# EAGLE design BME280 breakout (EAGLE 7.3.0)
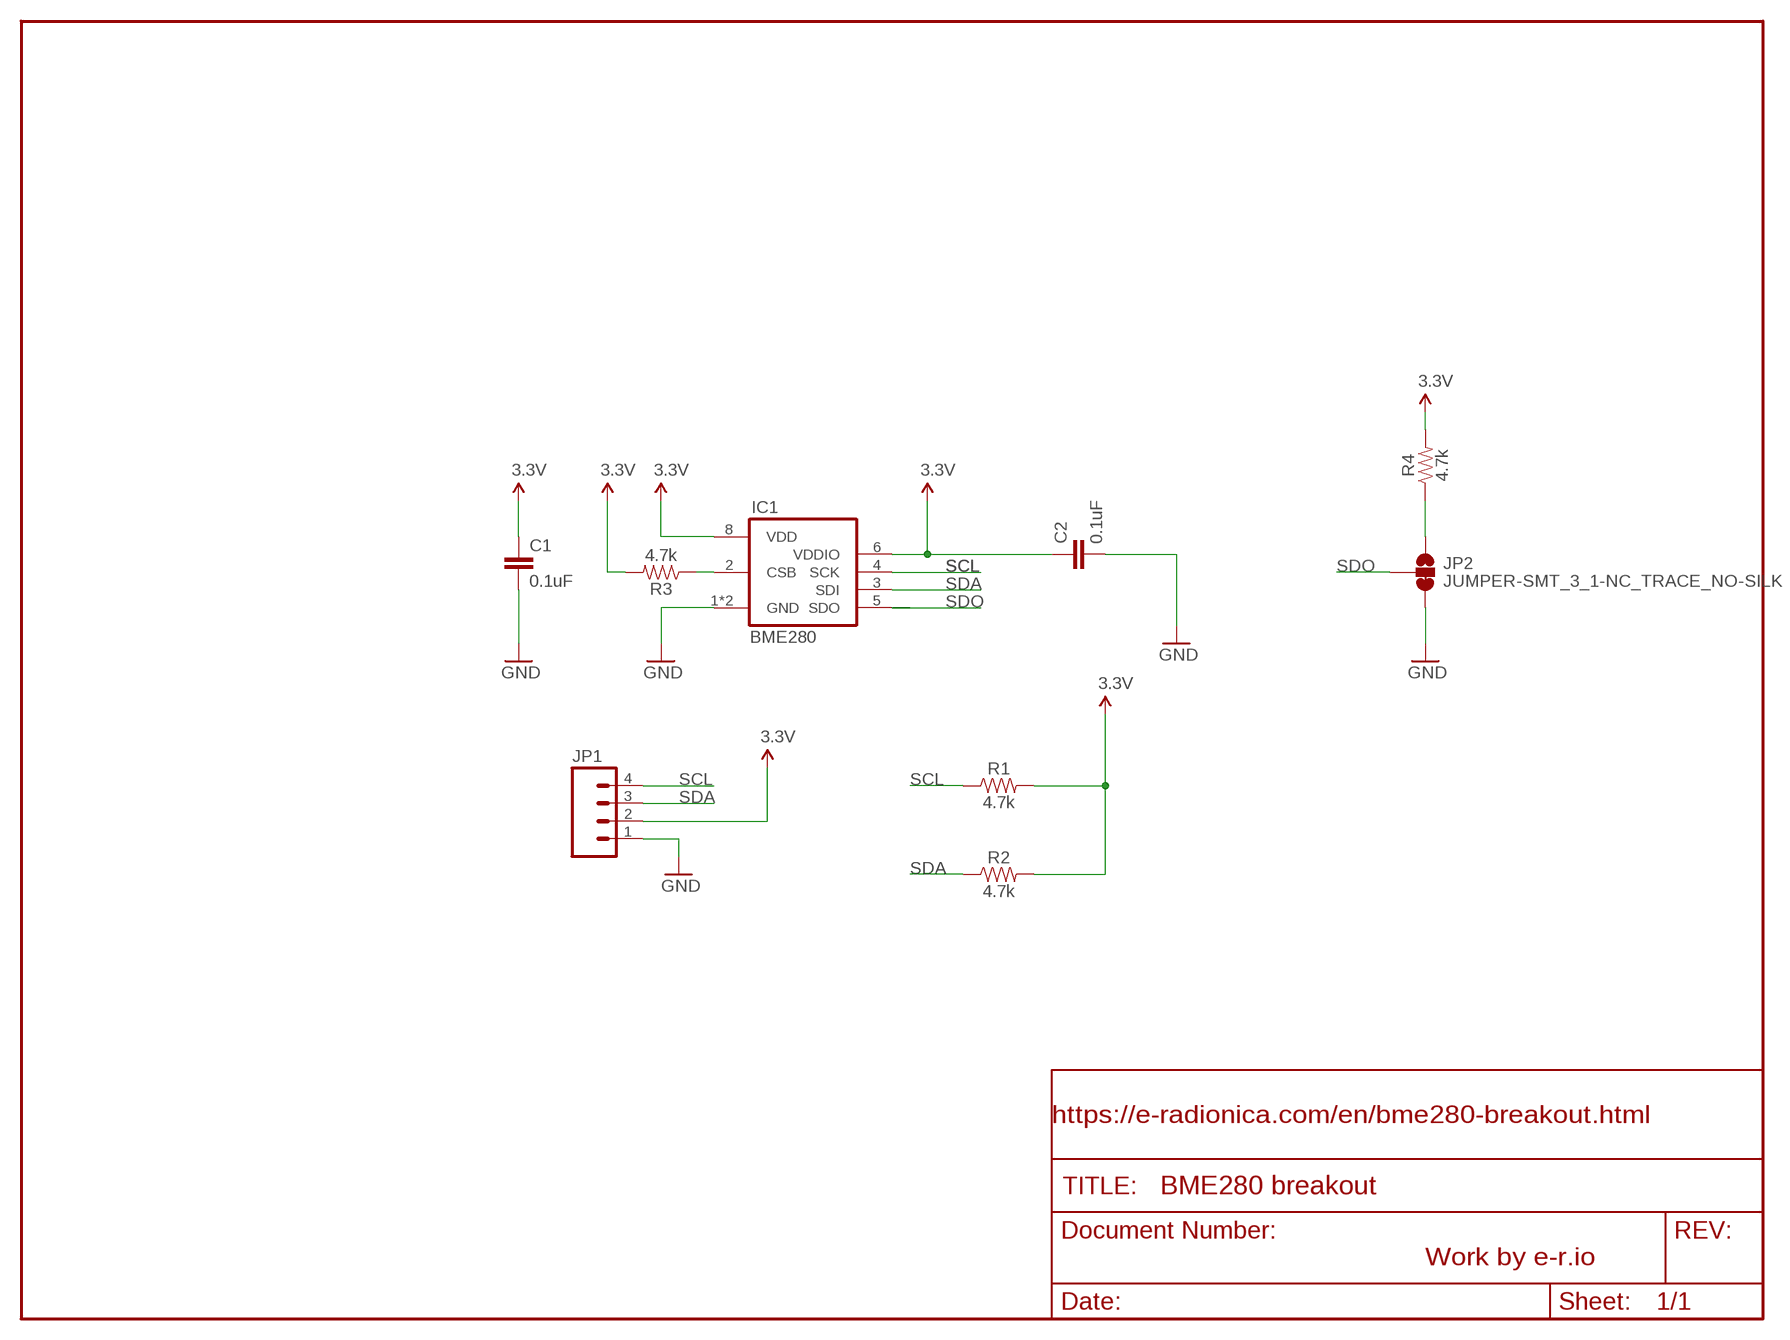
[diagram p0: schematic, sheet 1]

## Parts
C1  0.1uF  0.1UF-0603-25V-(+80/-20%)  [0603]
C2  0.1uF  0.1UF-0603-25V-(+80/-20%)  [0603]
IC1  BME280  [BME280]
JP1  M04PTH  [1X04]
JP2  JUMPER-SMT_3_1-NC_TRACE_NO-SILK  [SMT-JUMPER_3_1-NC_TRACE_NO-SILK]
R1  4.7k  4.7KOHM-0603-1/10W-1%  [0603]
R2  4.7k  4.7KOHM-0603-1/10W-1%  [0603]
R3  4.7k  4.7KOHM-0603-1/10W-1%  [0603]
R4  4.7k  4.7KOHM-0603-1/10W-1%  [0603]

## Nets
3.3V: C1.1 C2.1 IC1.6(VDDIO) IC1.8(VDD) JP1.2 R1.2 R2.2 R3.2 R4.2
GND: C1.2 C2.2 IC1.1(GND) IC1.7(GND) JP1.1 JP2.3
N$1: IC1.2(CSB) R3.1
N$4: JP2.1 R4.1
SCL: IC1.4(SCK) JP1.4 R1.1
SDA: IC1.3(SDI) JP1.3 R2.1
SDO: IC1.5(SDO) JP2.2

## Notes on the sheet
- https://e-radionica.com/en/bme280-breakout.html
- Work by e-r.io

## Library data of the parts
C1 C2 = SparkFun-Capacitors:0.1UF: 0.1µF ceramic capacitors A capacitor is a passive two-terminal electrical component used to store electrical energy temporarily in an electric field.; PROD_ID: CAP-00810
IC1 = bosch-bme280:BME280: DIGITAL HUMIDITY, PRESSURE AND TEMPERATURE SENSOR * Digital interface I²C (up to 3.4 MHz) and SPI (3 and 4 wire, up to 10 MHz)* Supply voltage VDD main supply voltage range: 1.71 V to 3.6 V*VDDIO interface voltage range: 1.2 V to 3.6 V Operating range -40…+85 °C, 0…100 % rel. humidity, 300…1100 hPa The library has been designed by Richard Magdycz <https://www.facebook.com/groups/eaglecadsoftUK>
JP1 = SparkFun:M04: Header 4 Standard 4-pin 0.1" header. Use with straight break away headers (SKU : PRT-00116), right angle break away headers (PRT-00553), swiss pins (PRT-00743), machine pins (PRT-00117), and female headers (PRT-00115). Molex polarized connector foot print use with SKU : PRT-08231 with associated crimp pins and housings. 1MM SMD Version SKU: PRT-10208
JP2 = SparkFun-Jumpers:JUMPER-SMT_3_1-NC_TRACE: Normally closed trace jumper (1 of 2 connections) This jumper has a trace between two pads so it's normally closed (NC). The other connection is normally open (NO). Use a razor knife to open the connection. For best results follow the IPC guidelines for cutting traces: Cutout at least 0.063 mm (0.005 in). Remove all loose material to clean up the cut area. Seal the cut with an approved epoxy. Reapply solder to reclose the connection, or to close the NO connection.
R1-R4 = SparkFun-Resistors:4.7KOHM: 4.7kΩ resistor A resistor is a passive two-terminal electrical component that implements electrical resistance as a circuit element. Resistors act to reduce current flow, and, at the same time, act to lower voltage levels within circuits. - Wikipedia; PROD_ID: RES-07857

## Board
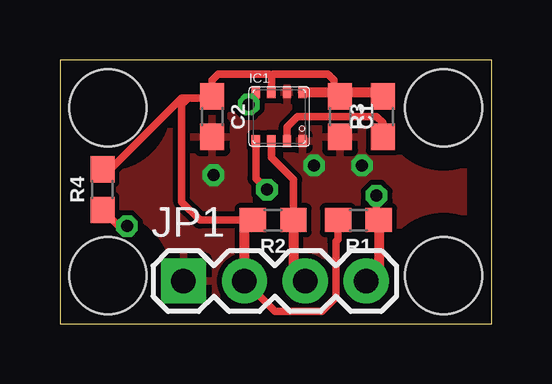
[diagram p1: board, top side]
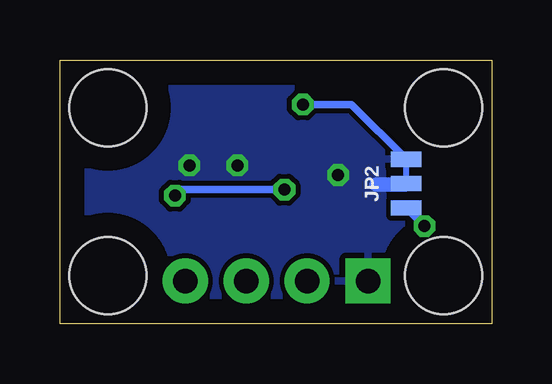
[diagram p2: board, bottom side, seen from below]

Size 18 x 11 mm. Coordinates in mm from the lower left corner, seen from the top.
Outline: 0,0 18,0 18,11 0,11 0,0
Copper layers (1*16): Top 0.035mm / dielectric 1.5mm / Bottom 0.035mm
Design rules "default": minimum track width 10mil, minimum drill 24mil, track to track 8mil, track to pad 8mil, pad to pad 8mil, via to via 8mil, smd to smd 8mil, copper to edge 40mil, drill to drill 8mil, minimum pad ring 10mil, minimum via ring 8mil, stop-mask expansion 4mil, vias tented up to drill 0mil, thermal gap 10mil
Holes 3.2 mm at 2,2 16,2 2,9 16,9

### Footprints (pad centres in the part's own frame; a part is rotated, then mirrored left to right if it is on the bottom)
0603 = smd 1.1 x 1: 1 -0.85,0; 2 0.85,0
BME280 = smd 0.35 x 0.5: 1 0.975,-1.025; 2 0.325,-1.025; 3 -0.325,-1.025; 4 -0.975,-1.025; 5 -0.975,1.025; 6 -0.325,1.025; 7 0.325,1.025; 8 0.975,1.025
1X04 = drill 1.016 pad 1.88 square: 1 0,0 | drill 1.016 pad 1.88: 2 2.54,0; 3 5.08,0; 4 7.62,0
SMT-JUMPER_3_1-NC_TRACE_NO-SILK = smd 0.635 x 1.27: 1 -1.016,0; 2 0,0; 3 1.016,0

### Placement (x,y rotation side)
C1  11.68,8.64 270 top
C2  6.35,8.64 270 top
IC1  9.14,8.64 0 top
JP1  5.15,1.78 0 top
JP2  3.56,5.84 90 bottom
R1  12.45,4.32 180 top
R2  8.89,4.32 180 top
R3  13.46,8.64 90 top
R4  1.78,5.59 90 top
U$1  [OSH3MM]  14.4,4 0 top
U$2  [NOVI_LOGO-4MM]  3.4,3.2 0 top

### Tracks (layer width: path | path; a pad name or v marks a point on that pad's centre or on a via)
3.3V
  Top 0.305: IC1.6 8.82,10.34 | 8.82,10.34 8.89,10.41 11.18,10.41 11.43,10.16 11.43,9.74 C1.1 11.52,9.65 10.16,9.65 10.15,9.66 IC1.8 | 8.82,10.34 8.75,10.41 6.6,10.41 6.35,10.16 C2.1 6.26,9.4 5.33,9.4 | R4.2 2.12,6.44 5.08,9.4 5.33,9.4 | R2.2 5.84,4.32 5.08,5.08 5.08,9.14 5.33,9.4 | R1.2 11.6,3.52 11.51,3.43 11.51,1.09 10.92,0.51 8.96,0.51 JP1.2
  Top 0.406: JP1.2 7.69,3.97 R2.2 | IC1.8 13.29,9.66 R3.2
GND  (via drill 0.5)
  Bottom 0.305: 3.6,5.8 3.56,5.84
  Bottom 0.61: 3.6,5.8 4.8,5.8
  other vias: 12.6,6.6 6.4,6.2 10.6,6.6
  pour Top: 0,0 18,0 18,11 0,11
  pour Bottom: 0,0 18,0 18,11 0,11
N$1
  Top 0.305: IC1.2 9.47,8.2 9.91,8.64 13.21,8.64 13.46,8.38 R3.1
N$4  (via drill 0.5)
  Top 0.305: v2.79,4.06 2.45,4.06 R4.1
  Bottom 0.305: JP2.1 v2.79,4.06
SCL  (via drill 0.5)
  Top 0.305: IC1.4 8.17,6.05 v8.64,5.59 | v13.21,5.33 13.21,4.41 R1.1
  Top 0.406: R1.1 13.3,2.3 JP1.4
  Bottom 0.305: v8.64,5.59 12.95,5.59 v13.21,5.33
SDA
  Top 0.305: R2.1 9.74,6.01 8.82,6.93 IC1.3
  Top 0.406: R2.1 9.74,2.27 JP1.3
SDO  (via drill 0.5)
  Top 0.305: IC1.5 8.17,9.44 v7.87,9.14
  Bottom 0.305: v7.87,9.14 5.84,9.14 3.56,6.86

### Text on the board
200bmp: BME280 breakout
208bmp: e-radionica.com | 3.3V | gnd | SDA | SCL